# Altium schematic sheet QCopterFC_FFC_Sch.SchDoc
size A4
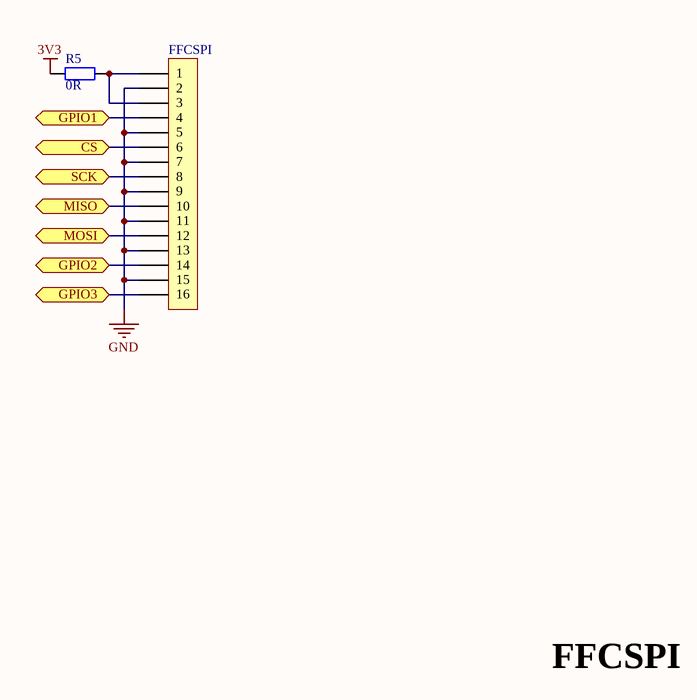
[diagram p0: QCopterFC_FFC_Sch.SchDoc]

## Parts
FFCSPI  FFC_0.5_16  [FFC_0.5_16]  (value not drawn)
R5  value 0R  [RES_0603]  (hidden comment: Res_0603)

## Ports
CS, GPIO1, GPIO2, GPIO3, MISO, MOSI, SCK

## Nets
3V3: R5.1
GND: FFCSPI.2 FFCSPI.5 FFCSPI.7 FFCSPI.9 FFCSPI.11 FFCSPI.13 FFCSPI.15
CS: FFCSPI.6 ; port CS
GPIO1: FFCSPI.4 ; port GPIO1
GPIO2: FFCSPI.14 ; port GPIO2
GPIO3: FFCSPI.16 ; port GPIO3
MISO: FFCSPI.10 ; port MISO
MOSI: FFCSPI.12 ; port MOSI
SCK: FFCSPI.8 ; port SCK
NetFFCSPI_1: FFCSPI.1 FFCSPI.3 R5.2

## Notes on the sheet
- FFCSPI

## Library data of the parts
FFCSPI = FFC_0.5_16: FFC
R5 = Res_0603: Resistor